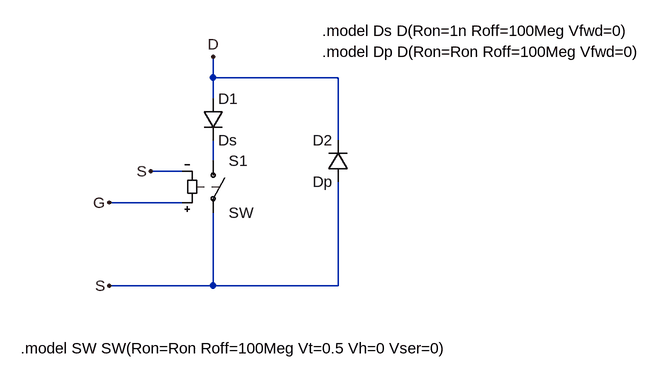
[diagram p0: schematic iSW.asc]
iSW.asc, the LTspice schematic file:
Version 4
SHEET 1 880 680
WIRE 160 -32 160 -64
WIRE 352 -32 160 -32
WIRE 160 0 160 -32
WIRE 352 64 352 -32
WIRE 160 96 160 64
WIRE 112 112 64 112
WIRE 112 160 0 160
WIRE 160 288 0 288
WIRE 160 288 160 176
WIRE 352 288 352 128
WIRE 352 288 160 288
FLAG 0 160 G
FLAG 0 288 S
FLAG 160 -64 D
FLAG 64 112 S
SYMBOL sw 160 80 R0
SYMATTR InstName S1
SYMBOL diode 144 0 R0
SYMATTR InstName D1
SYMATTR Value Ds
SYMBOL diode 368 128 R180
WINDOW 0 24 64 Left 2
WINDOW 3 24 0 Left 2
SYMATTR InstName D2
SYMATTR Value Dp
TEXT -136 384 Left 2 !.model SW SW(Ron=Ron Roff=100Meg Vt=0.5 Vh=0 Vser=0)
TEXT 328 -104 Left 2 !.model Ds D(Ron=1n Roff=100Meg Vfwd=0)
TEXT 328 -72 Left 2 !.model Dp D(Ron=Ron Roff=100Meg Vfwd=0)

The netlist it stands for:
* iSW.asc
S1 N001 S G S SW
D1 D N001 Ds
D2 S D Dp
.model D D
.lib standard.dio
.model SW SW(Ron=Ron Roff=100Meg Vt=0.5 Vh=0 Vser=0)
.model Ds D(Ron=1n Roff=100Meg Vfwd=0)
.model Dp D(Ron=Ron Roff=100Meg Vfwd=0)
.backanno
.end